# Altium project Mini-DSO-WaveGen-in-one.PrjPcb
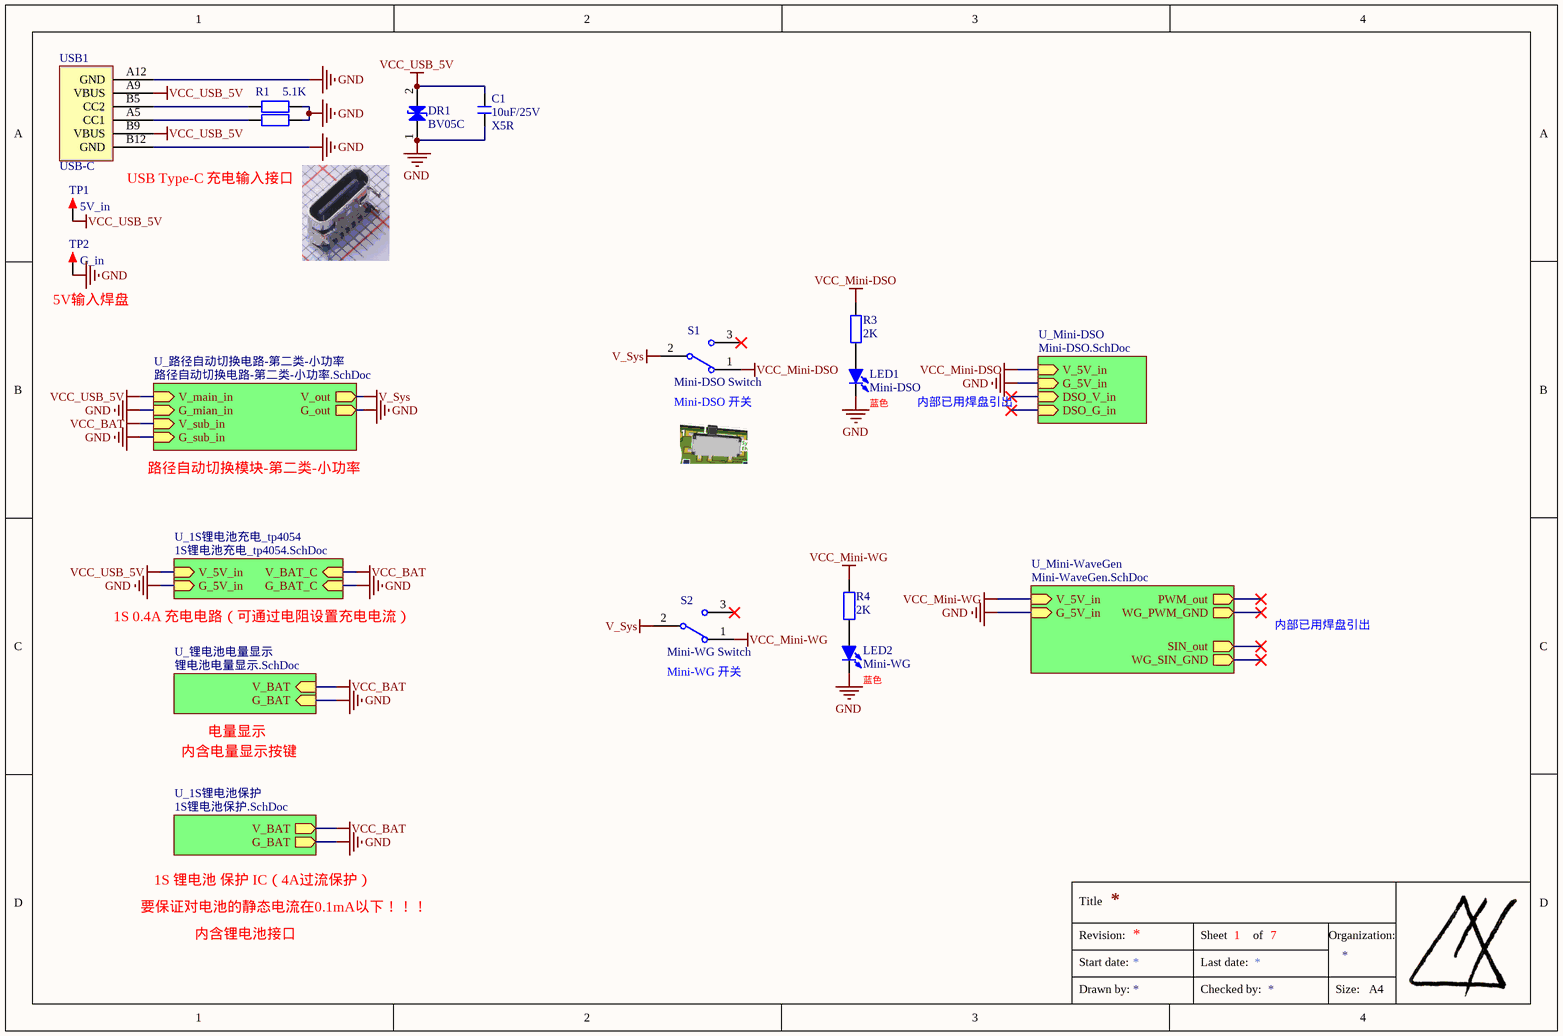
[diagram p0: Mini-DSO-WaveGen-in-one.SchDoc]
7 sheets, 160 parts. Net scope: hierarchical (ports join the sheet entries above them; power ports are global).
Board file: Mini-DSO-WaveGen-in-one.PcbDoc
Sheets:
  Mini-DSO-WaveGen-in-one.SchDoc
    U_1S锂电池保护 = 1S锂电池保护.SchDoc
    U_锂电池电量显示 = 锂电池电量显示.SchDoc
    U_1S锂电池充电_tp4054 = 1S锂电池充电_tp4054.SchDoc
    U_路径自动切换电路-第二类-小功率 = 路径自动切换电路-第二类-小功率.SchDoc
    U_Mini-WaveGen = Mini-WaveGen.SchDoc
    U_Mini-DSO = Mini-DSO.SchDoc

## Sheet Mini-DSO-WaveGen-in-one.SchDoc
size A4; SheetNumber: 1; SheetTotal: 7

### Parts
C1  10uF/25V  BOM名称: X5R  [C 0603_L]
DR1  BV05C  [SOD-323]
LED1  Mini-DSO  [LED 0805R]
LED2  Mini-WG  [LED 0805R]
R1  5.1K  [R 0402_L]
R2  5.1K  [R 0402_L]  (value not drawn)
R3  2K  [R 0402_L]
R4  2K  [R 0402_L]
S1  Mini-DSO Switch  [MSK-12C01-07]
S2  Mini-WG Switch  [MSK-12C01-07]
TP1  5V_in  [TEST 1.6]
TP2  G_in  [TEST 1.6]
USB1  USB-C  [USB-C/S_C]

### Sub-sheets
U_1S锂电池保护 = 1S锂电池保护.SchDoc: V_BAT (out), G_BAT (out)
U_1S锂电池充电_tp4054 = 1S锂电池充电_tp4054.SchDoc: V_5V_in (in), G_5V_in (in), V_BAT_C (in), G_BAT_C (in)
U_Mini-DSO = Mini-DSO.SchDoc: V_5V_in (in), G_5V_in (in), DSO_V_in (in), DSO_G_in (in)
U_Mini-WaveGen = Mini-WaveGen.SchDoc: V_5V_in (in), G_5V_in (in), PWM_out (out), SIN_out (out), WG_PWM_GND (out), WG_SIN_GND (out)
U_路径自动切换电路-第二类-小功率 = 路径自动切换电路-第二类-小功率.SchDoc: V_main_in (in), G_mian_in (in), V_out (out), G_out (out), V_sub_in (in), G_sub_in (in)
U_锂电池电量显示 = 锂电池电量显示.SchDoc: V_BAT (in), G_BAT (in)

### Nets
GND: C1.1 DR1.1(A) LED1.2(K) LED2.2(K) R1.1 R2.1 TP2.1 USB1.A12(GND) USB1.B12(GND) ; sheet U_1S锂电池保护/G_BAT, sheet U_锂电池电量显示/G_BAT, sheet U_1S锂电池充电_tp4054/G_5V_in, sheet U_1S锂电池充电_tp4054/G_BAT_C, sheet U_路径自动切换电路-第二类-小功率/G_mian_in, sheet U_路径自动切换电路-第二类-小功率/G_out, sheet U_路径自动切换电路-第二类-小功率/G_sub_in, sheet U_Mini-WaveGen/G_5V_in, sheet U_Mini-DSO/G_5V_in  [project net G_BAT_out]
GND_Mini-WG: sheet U_Mini-WaveGen/WG_PWM_GND, sheet U_Mini-WaveGen/WG_SIN_GND
V_Sys: S1.2 S2.2 ; sheet U_路径自动切换电路-第二类-小功率/V_out
VCC_BAT: sheet U_1S锂电池保护/V_BAT, sheet U_锂电池电量显示/V_BAT, sheet U_1S锂电池充电_tp4054/V_BAT_C, sheet U_路径自动切换电路-第二类-小功率/V_sub_in  [project net V_BAT_C]
VCC_Mini-DSO: R3.1 S1.1 ; sheet U_Mini-DSO/V_5V_in
VCC_Mini-WG: R4.1 S2.1 ; sheet U_Mini-WaveGen/V_5V_in
VCC_USB_5V: C1.2 DR1.2(K) TP1.1 USB1.A9(VBUS) USB1.B9(VBUS) ; sheet U_1S锂电池充电_tp4054/V_5V_in, sheet U_路径自动切换电路-第二类-小功率/V_main_in  [project net VCC_5V]
NetLED1_1: LED1.1(A) R3.2
NetLED2_1: LED2.1(A) R4.2
NetR1_2: R1.2 USB1.B5(CC2)
NetR2_2: R2.2 USB1.A5(CC1)

Not connected (* = marked no-connect by the designer): S1 3*; S2 3*

### Notes on the sheet
- (near USB1) USB Type-C 充电输入接口
- (near TP2) 5V输入焊盘
- (near S1) Mini-DSO 开关
- (near LED1) 蓝色
- 内部已用焊盘引出
- 路径自动切换模块-第二类-小功率
- 1S 0.4A 充电电路（可通过电阻设置充电电流）
- (near S2) Mini-WG 开关
- (near LED2) 蓝色
- 内含电量显示按键
- 电量显示
- 要保证对电池的静态电流在0.1mA以下！！！
- 1S 锂电池 保护 IC（4A过流保护）
- 内含锂电池接口
- Title
- Start date:
- Revision:
- Sheet
- Last date:
- of
- Organization:
- Drawn by:
- Checked by:
- Size:
- A4

### Library data of the parts
C1 = C X5R: 无极性贴片电容 X5R
DR1 = DR: 瞬态电压抑制二极管; 版权归属: 源创客; BOM名称: 瞬态电压抑制二极管; 学习资源: www.ooocke.com
LED1 = LED-SMD: 蓝色 贴片LED; 版权归属: 源创客; BOM名称: 蓝色 贴片LED; 学习资源: www.ooocke.com
LED2 = LED-SMD: 贴片LED 蓝色; BOM名称: 蓝色 贴片LED; 版权归属: 源创客; 学习资源: www.ooocke.com
R1-R4 = R: 贴片电阻 E-96 1%; BOM名称: E-96 1%
S1 S2 = SSW-1P: 1路拨动开关; pin to pad: 1>3 3>1; BOM名称: 拨动开关; 版权归属: 源创客; 学习资源: www.ooocke.com
TP1 TP2 = TEST: 测试点; 版权归属: 源创客; BOM名称: 测试点; 学习资源: www.ooocke.com
USB1 = USB-C_6P/S: USB-C_6P型母接口; BOM名称: USB-C型母接口; 版权归属: 源创客; 学习资源: www.ooocke.com

## Sheet 1S锂电池保护.SchDoc
size A4; SheetNumber: 4; SheetTotal: 7
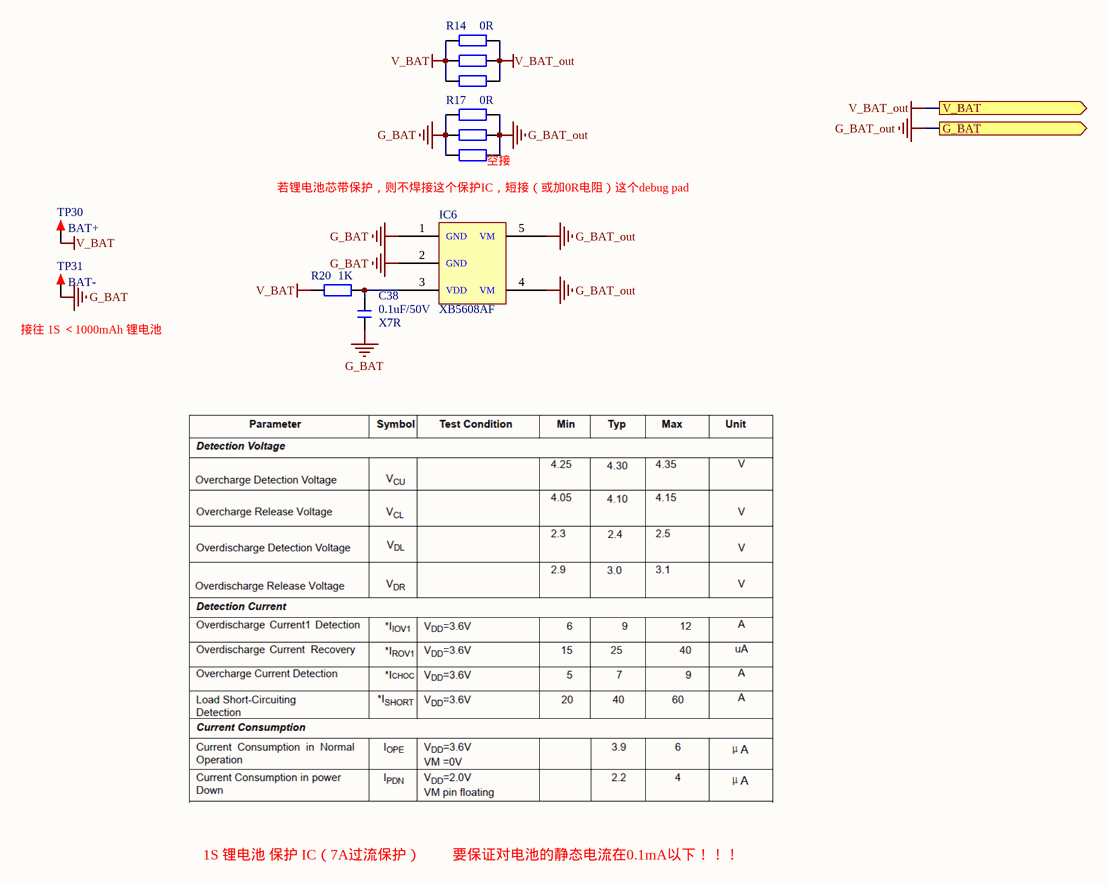
[diagram p1: 1S锂电池保护.SchDoc]

### Parts
C38  0.1uF/50V  BOM名称: X7R  [C 0402_L]
IC6  XB5608AF  [SOT23-5N]
R14  0R  [R 0402_L]
R15  0R  [R 0402_L]  (value not drawn)
R16  0R  [R 0402_L]  (value not drawn)
R17  0R  [R 0402_L]
R18  0R  [R 0402_L]  (value not drawn)
R19  0R  [R 0402_L]  (value not drawn)
R20  1K  [R 0402_L]
TP30  BAT+  [TEST 1.6]
TP31  BAT-  [TEST 1.6]

### Ports
G_BAT (out), V_BAT (out)

### Nets
G_BAT: C38.1 IC6.1 IC6.2 R17.1 R18.1 R19.1 TP31.1
G_BAT_out: IC6.4 IC6.5 R17.2 R18.2 R19.2 ; port G_BAT
V_BAT: R14.1 R15.1 R16.1 R20.1 TP30.1
V_BAT_out: R14.2 R15.2 R16.2 ; port V_BAT  [project net V_BAT_C]
NetC38_2: C38.2 IC6.3 R20.2

### Notes on the sheet
- 若锂电池芯带保护，则不焊接这个保护IC，短接（或加0R电阻）这个debug pad
- (near R19) 空接
- (near IC6) GND
- (near IC6) VM
- (near TP31) 接往 1S ＜1000mAh 锂电池
- (near IC6) VDD
- 1S 锂电池 保护 IC（7A过流保护）
- 要保证对电池的静态电流在0.1mA以下！！！
- Title
- Start date:
- Revision:
- Sheet
- Last date:
- of
- Organization:
- Drawn by:
- Checked by:
- Size:
- A4

### Library data of the parts
C38 = C X7R: 无极性贴片电容 X7R
IC6 = 5: 锂电池 二合一保护IC; BOM名称: 锂电池 二合一保护IC
R14-R20 = R: 贴片电阻 E-96 1%; BOM名称: E-96 1%
TP30 TP31 = TEST: 测试点; 版权归属: 源创客; BOM名称: 测试点; 学习资源: www.ooocke.com

## Sheet 锂电池电量显示.SchDoc
size A4; SheetNumber: 5; SheetTotal: 7
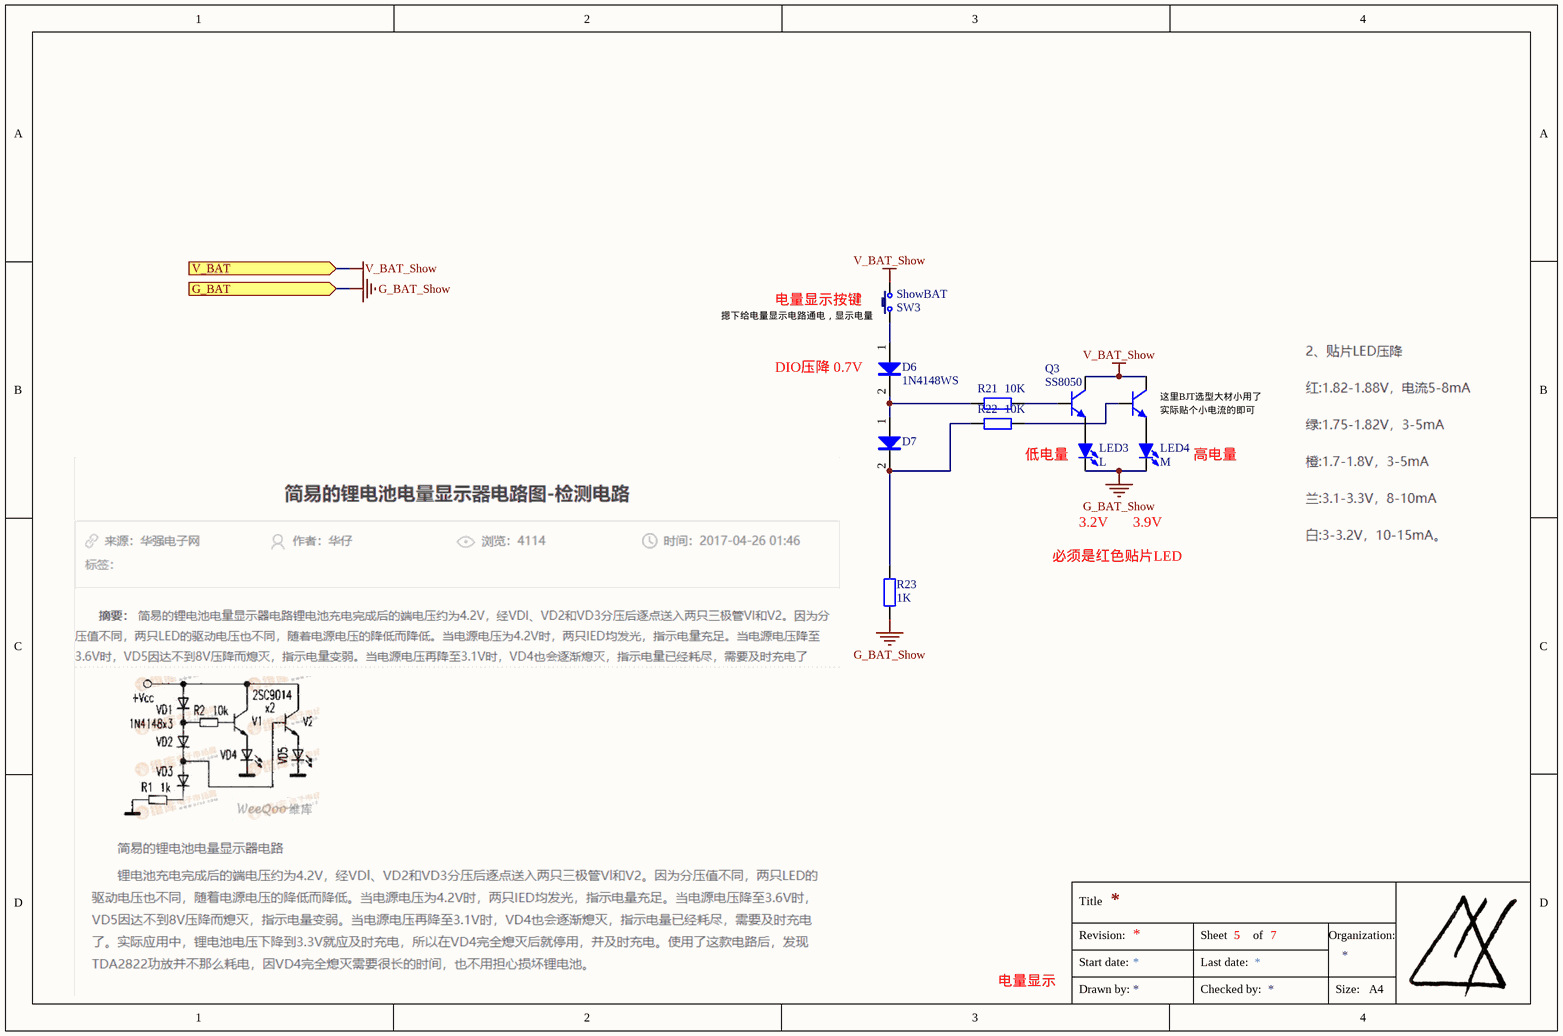
[diagram p2: 锂电池电量显示.SchDoc]

### Parts
D6  1N4148WS  [SOD-323]
D7  1N4148WS  [SOD-323]  (value not drawn)
LED3  L  [LED 0805R]
LED4  M  [LED 0805R]
Q3  SS8050  [SOT23-3N]
Q4  SS8050  [SOT23-3N]  (value not drawn)
R21  10K  [R 0402_L]
R22  10K  [R 0402_L]
R23  1K  [R 0402_L]
SW3  ShowBAT  [TSW DIP-3*6*5_V]

### Ports
G_BAT (in), V_BAT (in)

### Nets
G_BAT_Show: LED3.2(K) LED4.2(K) R23.2 ; port G_BAT  [project net G_BAT_out]
V_BAT_Show: Q3.3(C) Q4.3(C) SW3.2 ; port V_BAT  [project net V_BAT_C]
NetD6_1: D6.1(A) SW3.1
NetD6_2: D6.2(K) D7.1(A) R21.1
NetD7_2: D7.2(K) R22.1 R23.1
NetLED3_1: LED3.1(A) Q3.2(E)
NetLED4_1: LED4.1(A) Q4.2(E)
NetQ3_1: Q3.1(B) R21.2
NetQ4_1: Q4.1(B) R22.2

### Notes on the sheet
- 电量显示按键
- 摁下给电量显示电路通电，显示电量
- DIO压降 0.7V
- (near Q4) 这里BJT选型大材小用了
- (near Q4) 实际贴个小电流的即可
- 低电量
- 高电量
- 必须是红色贴片LED
- 3.2V
- 3.9V
- 电量显示
- Title
- Start date:
- Revision:
- Sheet
- Last date:
- of
- Organization:
- Drawn by:
- Checked by:
- Size:
- A4

### Library data of the parts
D6 D7 = 1N4148: 高速开关二极管; 版权归属: 源创客; BOM名称: 高速开关二极管; 学习资源: www.ooocke.com
LED3 LED4 = LED-SMD: 贴片LED 红色; 版权归属: 源创客; BOM名称: 贴片LED 红色; 学习资源: www.ooocke.com
Q3 Q4 = 8050-SMD: 高频放大-NPN型; 版权归属: 源创客; 属性: 40V 1.5A 1W 100MHZ; BOM名称: 高频放大-NPN型; 学习资源: www.ooocke.com
R21-R23 = R: 贴片电阻 E-96 1%; BOM名称: E-96 1%
SW3 = TSW 3x6: 3x6轻触开关; 版权归属: 源创客; BOM名称: 3x6轻触开关; 学习资源: www.ooocke.com

## Sheet 1S锂电池充电_tp4054.SchDoc
size A4; SheetNumber: 6; SheetTotal: 7
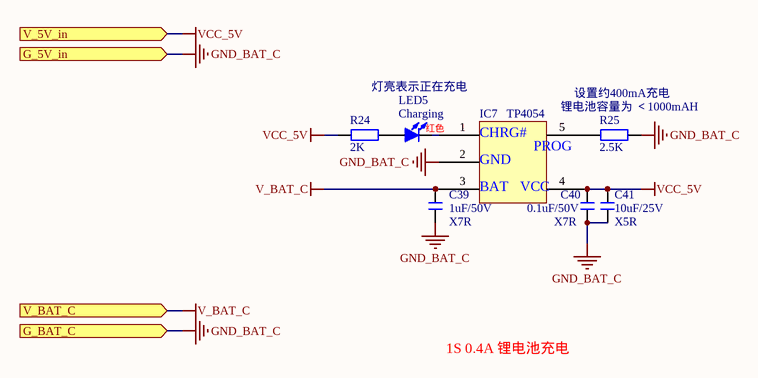
[diagram p3: 1S锂电池充电_tp4054.SchDoc]

### Parts
C39  1uF/50V  BOM名称: X7R  [C 0603_L]
C40  0.1uF/50V  BOM名称: X7R  [C 0402_L]
C41  10uF/25V  BOM名称: X5R  [C 0603_L]
IC7  TP4054  [SOT23-5N]
LED5  Charging  [LED 0805R]
R24  2K  [R 0402_L]
R25  2.5K  [R 0402_L]

### Ports
G_5V_in (in), G_BAT_C (in), V_5V_in (in), V_BAT_C (in)

### Nets
GND_BAT_C: C39.1 C40.2 C41.1 IC7.2 R25.2 ; port G_5V_in, port G_BAT_C  [project net G_BAT_out]
V_BAT_C: C39.2 IC7.3 ; port V_BAT_C
VCC_5V: C40.1 C41.2 IC7.4 R24.2 ; port V_5V_in
NetIC7_1: IC7.1 LED5.2(K)
NetIC7_5: IC7.5 R25.1
NetLED5_1: LED5.1(A) R24.1

### Notes on the sheet
- 灯亮表示正在充电
- 锂电池容量为 ＜1000mAH
- 设置约400mA充电
- (near LED5) 红色
- (near IC7) CHRG#
- (near IC7) GND
- (near IC7) BAT
- (near IC7) VCC
- (near IC7) PROG
- 1S 0.4A 锂电池充电
- Title
- Start date:
- Revision:
- Sheet
- Last date:
- of
- Organization:
- Drawn by:
- Checked by:
- Size:
- A4

### Library data of the parts
C39 C40 = C X7R: 无极性贴片电容 X7R
C41 = C X5R: 无极性贴片电容 X5R
IC7 = 5: 1S锂电充电; BOM名称: 1S锂电充电
LED5 = LED-SMD: 红色 贴片LED; 版权归属: 源创客; BOM名称: 红色 贴片LED; 学习资源: www.ooocke.com
R24 R25 = R: 贴片电阻 E-96 1%; BOM名称: E-96 1%

## Sheet 路径自动切换电路-第二类-小功率.SchDoc
size A4; SheetNumber: 7; SheetTotal: 7
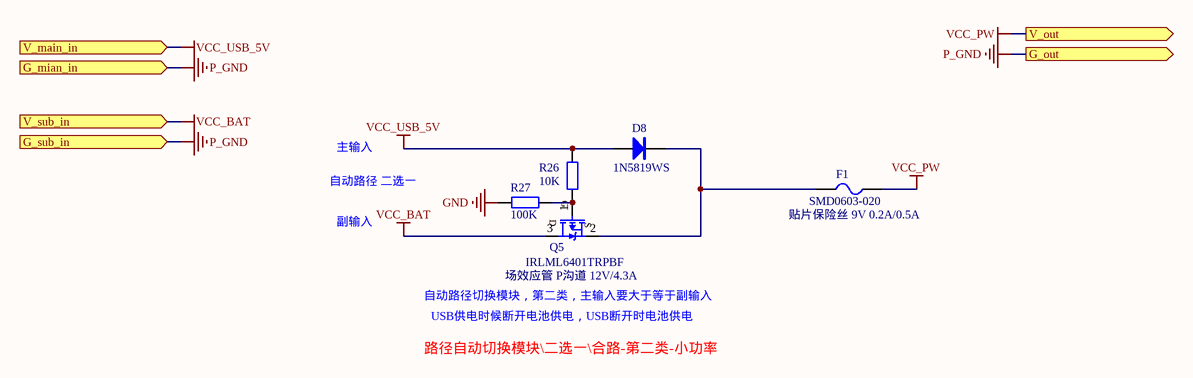
[diagram p4: 路径自动切换电路-第二类-小功率.SchDoc]

### Parts
D8  1N5819WS  [SOD-323]
F1  SMD0603-020  [FU 0603]
Q5  IRLML6401TRPBF  [SOT23-3N]
R26  10K  [R 0402_L]
R27  100K  [R 0402_L]

### Ports
G_mian_in (in), G_out (out), G_sub_in (in), V_main_in (in), V_out (out), V_sub_in (in)

### Nets
GND: R27.1 ; port G_mian_in, port G_out, port G_sub_in  [also labelled P_GND]  [project net G_BAT_out]
VCC_BAT: Q5.3(D) ; port V_sub_in  [project net V_BAT_C]
VCC_PW: F1.1 ; port V_out  [project net V_Sys]
VCC_USB_5V: D8.1(A) R26.2 ; port V_main_in  [project net VCC_5V]
NetD8_2: D8.2(K) F1.2 Q5.2(S)
NetQ5_1: Q5.1(G) R26.1 R27.2

### Notes on the sheet
- 主输入
- 自动路径 二选一
- 副输入
- 自动路径切换模块，第二类，主输入要大于等于副输入
- 路径自动切换模块\二选一\合路-第二类-小功率
- USB供电时候断开电池供电，USB断开时电池供电
- Title
- Start date:
- Revision:
- Sheet
- Last date:
- of
- Organization:
- Drawn by:
- Checked by:
- Size:
- A4

### Library data of the parts
D8 = 1N5819: 肖特基二极管; 版权归属: 源创客; 属性: 40V/2A; BOM名称: 肖特基二极管; 学习资源: www.ooocke.com
F1 = FU: 贴片保险丝 9V 0.2A/0.5A; 版权归属: 源创客; BOM名称: 贴片保险丝 9V 0.2A/0.5A; 学习资源: www.ooocke.com
Q5 = P-MOS: 场效应管 P沟道 12V/4.3A; 版权归属: 源创客; 学习资源: www.ooocke.com; BOM名称: 场效应管 P沟道 12V/4.3A
R26 R27 = R: 贴片电阻 E-96 1%; BOM名称: E-96 1%

## Sheet Mini-WaveGen.SchDoc
size A4; SheetNumber: 3; SheetTotal: 7
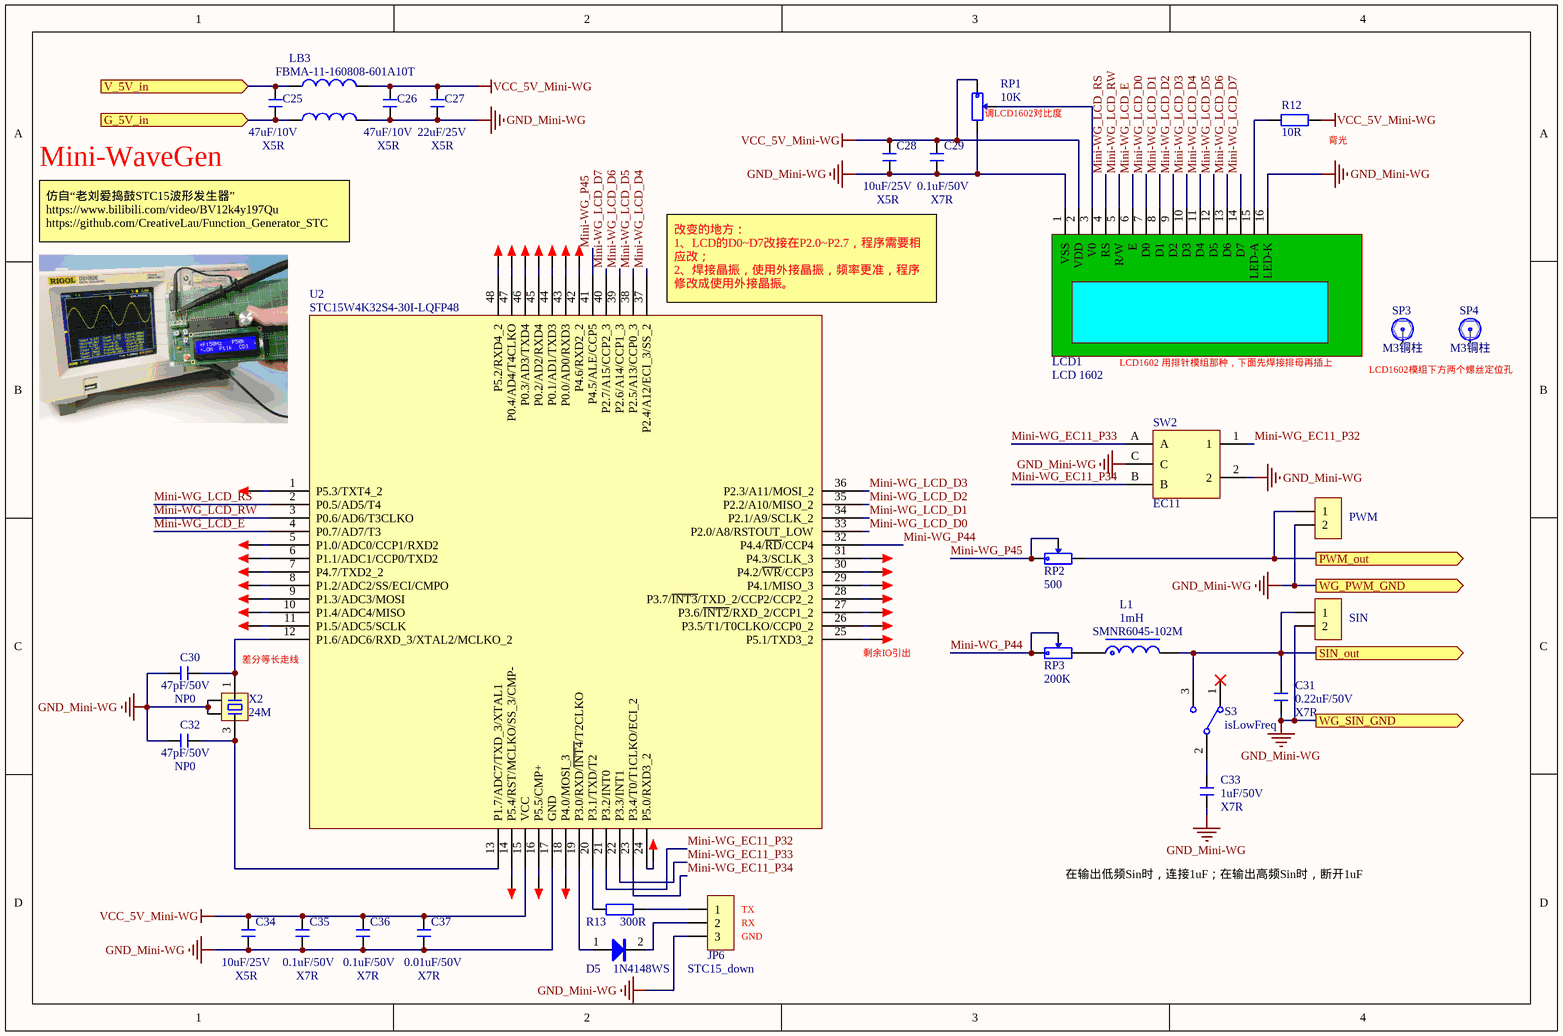
[diagram p5: Mini-WaveGen.SchDoc]

### Parts
C25  47uF/10V  BOM名称: X5R  [C 1206_L]
C26  47uF/10V  BOM名称: X5R  [C 1206_L]
C27  22uF/25V  BOM名称: X5R  [C 0805_L]
C28  10uF/25V  BOM名称: X5R  [C 0603_L]
C29  0.1uF/50V  BOM名称: X7R  [C 0402_L]
C30  47pF/50V  BOM名称: NP0  [C 0402_L]
C31  0.22uF/50V  BOM名称: X7R  [C 0603_L]
C32  47pF/50V  BOM名称: NP0  [C 0402_L]
C33  1uF/50V  BOM名称: X7R  [C 0603_L]
C34  10uF/25V  BOM名称: X5R  [C 0603_L]
C35  0.1uF/50V  BOM名称: X7R  [C 0402_L]
C36  0.1uF/50V  BOM名称: X7R  [C 0402_L]
C37  0.01uF/50V  BOM名称: X7R  [C 0402_L]
D5  1N4148WS  [SOD-323]
JP4  PWM  [HDR2.54-WS-2P]
JP5  SIN  [HDR2.54-WS-2P]
JP6  STC15_down  [HDR2.54-WS-3P]
L1  1mH  [NR6045]
LB3  FBMA-11-160808-601A10T  [FB 0603_L]
LB4  FBMA-11-160808-601A10T  [FB 0603_L]  (value not drawn)
LCD1  LCD 1602  [LCD-1602]
R12  10R  [R 0805_L]
R13  300R  [R 0402_L]
RP1  10K  [3362P]
RP2  500  [3362P]
RP3  200K  [3362P]
S3  isLowFreq  [MSK-12C01-07]
SP3  M3铜柱  [M3x4_L]
SP4  M3铜柱  [M3x4_L]
SW2  EC11  [EC11-B]
TP4  IO  [TEST 1]  (value not drawn)
TP5  IO  [TEST 1]  (value not drawn)
TP6  IO  [TEST 1]  (value not drawn)
TP7  IO  [TEST 1]  (value not drawn)
TP8  IO  [TEST 1]  (value not drawn)
TP9  IO  [TEST 1]  (value not drawn)
TP10  IO  [TEST 1]  (value not drawn)
TP11  IO  [TEST 1]  (value not drawn)
TP12  IO  [TEST 1]  (value not drawn)
TP13  IO  [TEST 1]  (value not drawn)
TP14  IO  [TEST 1]  (value not drawn)
TP15  IO  [TEST 1]  (value not drawn)
TP16  IO  [TEST 1]  (value not drawn)
TP17  IO  [TEST 1]  (value not drawn)
TP18  IO  [TEST 1]  (value not drawn)
TP19  IO  [TEST 1]  (value not drawn)
TP20  IO  [TEST 1]  (value not drawn)
TP21  IO  [TEST 1]  (value not drawn)
TP22  IO  [TEST 1]  (value not drawn)
TP23  IO  [TEST 1]  (value not drawn)
TP24  IO  [TEST 1]  (value not drawn)
TP25  IO  [TEST 1]  (value not drawn)
TP26  IO  [TEST 1]  (value not drawn)
TP27  IO  [TEST 1]  (value not drawn)
TP28  IO  [TEST 1]  (value not drawn)
TP29  IO  [TEST 1]  (value not drawn)
U2  STC15W4K32S4-30I-LQFP48  [LQFP48]
X2  24M  [OSC 3225-4P]

### Ports
G_5V_in (in), PWM_out (out), SIN_out (out), V_5V_in (in), WG_PWM_GND (out), WG_SIN_GND (out)

### Nets
G_BAT_out: C25.1 LB4.1 ; port G_5V_in
GND_Mini-WG: C26.1 C27.1 C28.1 C29.2 C30.2 C31.2 C32.2 C33.1 C34.1 C35.2 C36.2 C37.2 JP4.2 JP5.2 JP6.3 LB4.2 LCD1.1(VSS) LCD1.16(LED-K) RP1.3 SW2.2 SW2.C U2.17(GND) X2.2 X2.4 ; port WG_PWM_GND, port WG_SIN_GND
VCC_5V_Mini-WG: C26.2 C27.2 C28.2 C29.1 C34.2 C35.1 C36.1 C37.1 LB3.2 LCD1.2(VDD) R12.1 RP1.1 U2.15(VCC)
VCC_Mini-WG: C25.2 LB3.1 ; port V_5V_in
Mini-WG_EC11_P32: SW2.1 U2.21(P3.2/INT0)
Mini-WG_EC11_P33: SW2.A U2.22(P3.3/INT1)
Mini-WG_EC11_P34: SW2.B U2.23(P3.4/T0/T1CLKO/ECI_2)
Mini-WG_LCD_D0: LCD1.7(D0) U2.33(P2.0/A8/RSTOUT_LOW)
Mini-WG_LCD_D1: LCD1.8(D1) U2.34(P2.1/A9/SCLK_2)
Mini-WG_LCD_D2: LCD1.9(D2) U2.35(P2.2/A10/MISO_2)
Mini-WG_LCD_D3: LCD1.10(D3) U2.36(P2.3/A11/MOSI_2)
Mini-WG_LCD_D4: LCD1.11(D4) U2.37(P2.4/A12/ECI_3/SS_2)
Mini-WG_LCD_D5: LCD1.12(D5) U2.38(P2.5/A13/CCP0_3)
Mini-WG_LCD_D6: LCD1.13(D6) U2.39(P2.6/A14/CCP1_3)
Mini-WG_LCD_D7: LCD1.14(D7) U2.40(P2.7/A15/CCP2_3)
Mini-WG_LCD_E: LCD1.6(E) U2.4(P0.7/AD7/T3)
Mini-WG_LCD_RS: LCD1.4(RS) U2.2(P0.5/AD5/T4)
Mini-WG_LCD_RW: LCD1.5(R/W) U2.3(P0.6/AD6/T3CLKO)
Mini-WG_P44: RP3.1 RP3.2 U2.32(P4.4/~{RD}/CCP4)
Mini-WG_P45: RP2.1 RP2.2 U2.41(P4.5/ALE/CCP5)
NetC30_1: C30.1 U2.12(P1.6/ADC6/RXD_3/XTAL2/MCLKO_2) X2.1
NetC31_1: C31.1 JP5.1 L1.2 S3.3 ; port SIN_out
NetC32_1: C32.1 U2.13(P1.7/ADC7/TXD_3/XTAL1) X2.3
NetC33_2: C33.2 S3.2
NetD5_1: D5.1(A) U2.19(P3.0/RXD/~{INT4}/T2CLKO)
NetD5_2: D5.2(K) JP6.2
NetJP4_1: JP4.1 RP2.3 ; port PWM_out
NetJP6_1: JP6.1 R13.1
NetL1_1: L1.1 RP3.3
NetLCD1_3: LCD1.3(V0) RP1.2
NetLCD1_15: LCD1.15(LED-A) R12.2
NetR13_2: R13.2 U2.20(P3.1/TXD/T2)
NetTP4_1: TP4.1 U2.48(P5.2/RXD4_2)
NetTP5_1: TP5.1 U2.47(P0.4/AD4/T4CLKO)
NetTP6_1: TP6.1 U2.46(P0.3/AD3/TXD4)
NetTP7_1: TP7.1 U2.45(P0.2/AD2/RXD4)
NetTP8_1: TP8.1 U2.44(P0.1/AD1/TXD3)
NetTP9_1: TP9.1 U2.43(P0.0/AD0/RXD3)
NetTP10_1: TP10.1 U2.42(P4.6/RXD2_2)
NetTP11_1: TP11.1 U2.1(P5.3/TXT4_2)
NetTP12_1: TP12.1 U2.31(P4.3/SCLK_3)
NetTP13_1: TP13.1 U2.5(P1.0/ADC0/CCP1/RXD2)
NetTP14_1: TP14.1 U2.30(P4.2/~{WR}/CCP3)
NetTP15_1: TP15.1 U2.6(P1.1/ADC1/CCP0/TXD2)
NetTP16_1: TP16.1 U2.29(P4.1/MISO_3)
NetTP17_1: TP17.1 U2.7(P4.7/TXD2_2)
NetTP18_1: TP18.1 U2.28(P3.7/~{INT3}/TXD_2/CCP2/CCP2_2)
NetTP19_1: TP19.1 U2.8(P1.2/ADC2/SS/ECI/CMPO)
NetTP20_1: TP20.1 U2.27(P3.6/~{INT2}/RXD_2/CCP1_2)
NetTP21_1: TP21.1 U2.9(P1.3/ADC3/MOSI)
NetTP22_1: TP22.1 U2.26(P3.5/T1/T0CLKO/CCP0_2)
NetTP23_1: TP23.1 U2.10(P1.4/ADC4/MISO)
NetTP24_1: TP24.1 U2.25(P5.1/TXD3_2)
NetTP25_1: TP25.1 U2.11(P1.5/ADC5/SCLK)
NetTP26_1: TP26.1 U2.24(P5.0/RXD3_2)
NetTP27_1: TP27.1 U2.14(P5.4/RST/MCLKO/SS_3/CMP-)
NetTP28_1: TP28.1 U2.16(P5.5/CMP+)
NetTP29_1: TP29.1 U2.18(P4.0/MOSI_3)

Not connected (* = marked no-connect by the designer): S3 1*; SP3 1; SP4 1

### Notes on the sheet
- (near RP1) 调LCD1602对比度
- Mini-WaveGen
- (near R12) 背光
- 仿自“老刘爱捣鼓STC15波形发生器”
  https://www.bilibili.com/video/BV12k4y197Qu
  https://github.com/CreativeLau/Function_Generator_STC
- (near U2) 改变的地方：
  1、LCD的D0~D7改接在P2.0~P2.7，程序需要相应改；
  2、焊接晶振，使用外接晶振，频率更准，程序修改成使用外接晶振。
- LCD1602 用排针模组那种，下面先焊接排母再插上
- LCD1602模组下方两个螺丝定位孔
- (near TP24) 剩余IO引出
- 差分等长走线
- (near JP6) TX
- (near JP6) RX
- 在输出低频Sin时，连接1uF；在输出高频Sin时，断开1uF
- (near JP6) GND
- Title
- Start date:
- Revision:
- Sheet
- Last date:
- of
- Organization:
- Drawn by:
- Checked by:
- Size:
- A4

### Library data of the parts
C25-C28 C34 = C X5R: 无极性贴片电容 X5R
C29 C31 C33 C35-C37 = C X7R: 无极性贴片电容 X7R
C30 C32 = C NP0: 无极性贴片电容 NP0
D5 = 1N4148: 高速开关二极管; 版权归属: 源创客; BOM名称: 高速开关二极管; 学习资源: www.ooocke.com
JP4 JP5 = Header 2: 2P接插件; 版权归属: 源创客; BOM名称: 2P接插件; 学习资源: www.ooocke.com
JP6 = Header 3: 3P接插件; 版权归属: 源创客; BOM名称: 3P接插件; 学习资源: www.ooocke.com
L1 = L-NR: SMNR6045-102M; 版权归属: 源创客; BOM名称: SMNR6045-102M; 学习资源: www.ooocke.com
LB3 LB4 = LB: 磁珠 600R@100MHz; 版权归属: 源创客; BOM名称: 磁珠 600R@100MHz; 学习资源: www.ooocke.com
LCD1 = LCD 1602: 版权归属: 源创客; BOM名称: LCD 1602; 学习资源: www.ooocke.com
R12 R13 = R: 贴片电阻 E-96 1%; BOM名称: E-96 1%
RP1-RP3 = RP-ID: 插件单联电位器; BOM名称: 插件电位器; 版权归属: 源创客; 学习资源: www.ooocke.com
S3 = SSW-1P: 1路拨动开关; pin to pad: 1>3 3>1; BOM名称: 拨动开关; 版权归属: 源创客; 学习资源: www.ooocke.com
SP3 SP4 = 铜柱小焊盘: 铜柱; 版权归属: 源创客; BOM名称: 铜柱; 学习资源: www.ooocke.com
SW2 = EC11: 数字开关编码器; BOM名称: 数字编码开关; 版权归属: 源创客; 学习资源: www.ooocke.com
TP4-TP29 = TEST: 测试点; 版权归属: 源创客; BOM名称: 测试点; 学习资源: www.ooocke.com
U2 = STC15W4K60S4_LQFP48
X2 = XTAL-4P: 4脚无源晶振; 版权归属: 源创客; BOM名称: 4脚无源晶振; 学习资源: www.ooocke.com

## Sheet Mini-DSO.SchDoc
size A3; SheetNumber: 2; SheetTotal: 7
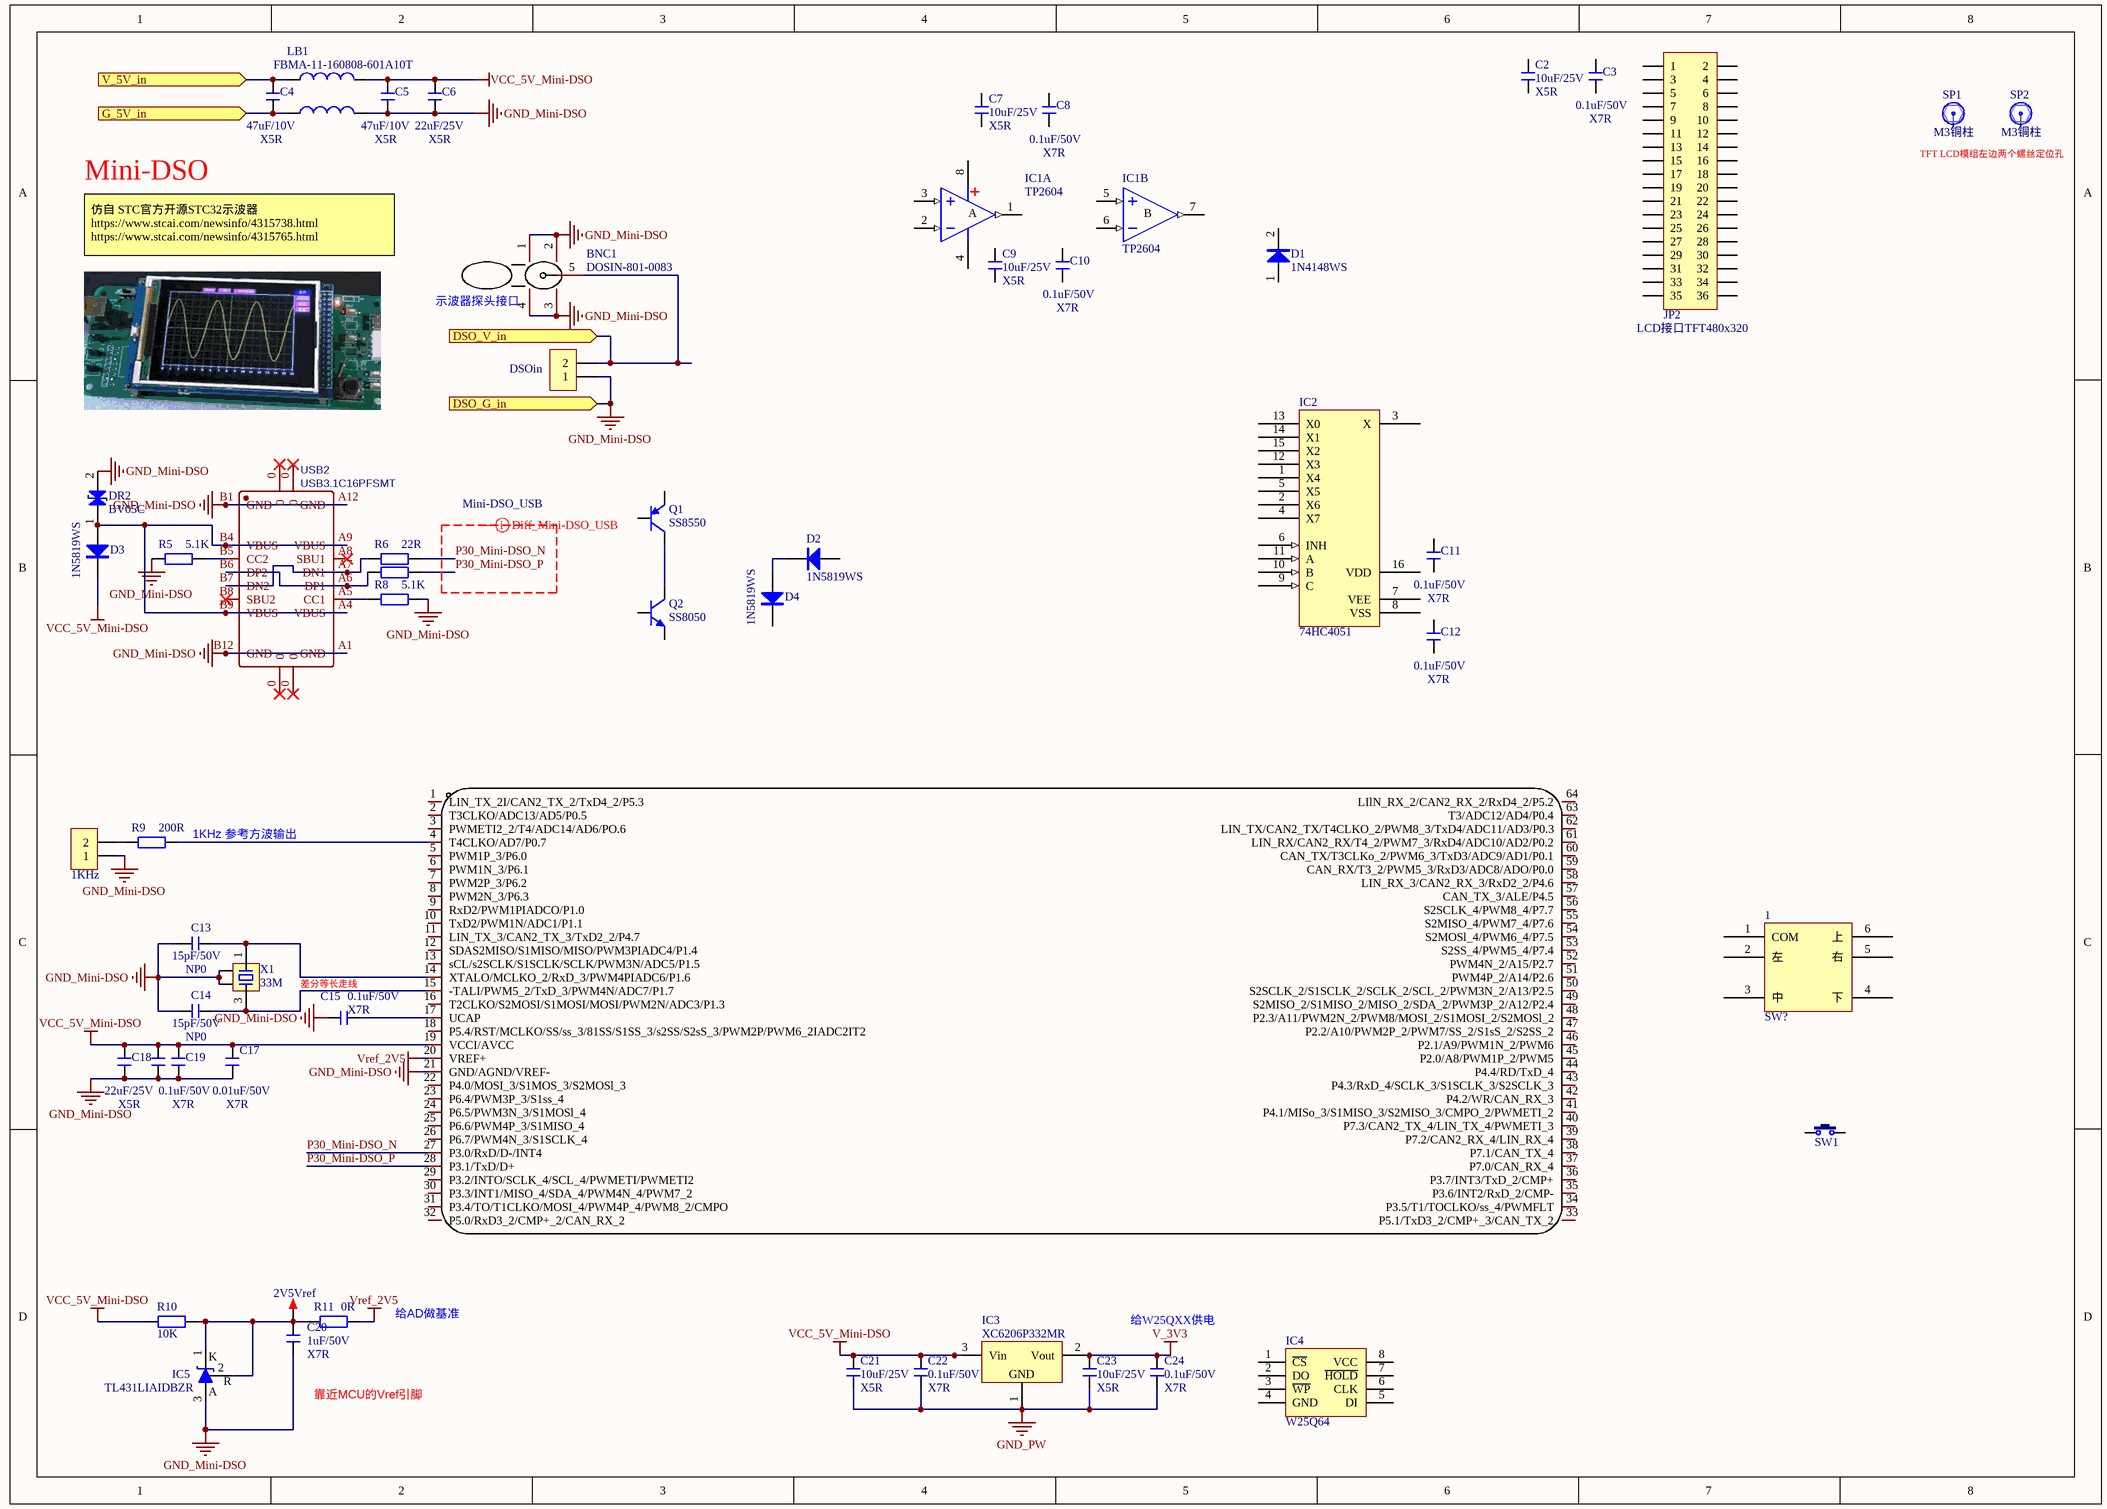
[diagram p6: Mini-DSO.SchDoc]

### Parts
1  SW?  [TSW 10x10x9-5Key-LS]
BNC1  DOSIN-801-0083  [BNC-TH_DOSIN-801-0083]
C2  10uF/25V  BOM名称: X5R  [C 0603_L]
C3  0.1uF/50V  BOM名称: X7R  [C 0402_L]
C4  47uF/10V  BOM名称: X5R  [C 1206_L]
C5  47uF/10V  BOM名称: X5R  [C 1206_L]
C6  22uF/25V  BOM名称: X5R  [C 0805_L]
C7  10uF/25V  BOM名称: X5R  [C 0603_L]
C8  0.1uF/50V  BOM名称: X7R  [C 0402_L]
C9  10uF/25V  BOM名称: X5R  [C 0603_L]
C10  0.1uF/50V  BOM名称: X7R  [C 0402_L]
C11  0.1uF/50V  BOM名称: X7R  [C 0402_L]
C12  0.1uF/50V  BOM名称: X7R  [C 0402_L]
C13  15pF/50V  BOM名称: NP0  [C 0402_L]
C14  15pF/50V  BOM名称: NP0  [C 0402_L]
C15  0.1uF/50V  BOM名称: X7R  [C 0402_L]
C16  0.1uF/50V  [C 0402_L]  (value not drawn)
C17  0.01uF/50V  BOM名称: X7R  [C 0402_L]
C18  22uF/25V  BOM名称: X5R  [C 0805_L]
C19  0.1uF/50V  BOM名称: X7R  [C 0402_L]
C20  1uF/50V  BOM名称: X7R  [C 0603_L]
C21  10uF/25V  BOM名称: X5R  [C 0603_L]
C22  0.1uF/50V  BOM名称: X7R  [C 0402_L]
C23  10uF/25V  BOM名称: X5R  [C 0603_L]
C24  0.1uF/50V  BOM名称: X7R  [C 0402_L]
D1  1N4148WS  [SOD-323]
D2  1N5819WS  [SOD-323]
D3  1N5819WS  [SOD-323]
D4  1N5819WS  [SOD-323]
DR2  BV05C  [SOD-323]
IC1  TP2604  [SOP8_N]  (parts A,B of 2)
IC2  74HC4051  [SOP16_N]
IC3  XC6206P332MR  [SOT23-3N]
IC4  W25Q64  [SOP8W_N]
IC5  TL431LIAIDBZR  [SOT23-3N]
JP1  DSOin  [HDR2.54-WS-2P]
JP2  LCD接口TFT480x320  [HDR2.54-LI-2x18P]
JP3  1KHz  [HDR2.54-WS-2P]
LB1  FBMA-11-160808-601A10T  [FB 0603_L]
LB2  FBMA-11-160808-601A10T  [FB 0603_L]  (value not drawn)
Q1  SS8550  [SOT23-3N]
Q2  SS8050  [SOT23-3N]
R5  5.1K  [R 0402_L]
R6  22R  [R 0402_L]
R7  22R  [R 0402_L]  (value not drawn)
R8  5.1K  [R 0402_L]
R9  200R  [R 0402_L]
R10  10K  [R 0402_L]
R11  0R  [R 0402_L]
SP1  M3铜柱  [M3x4_L]
SP2  M3铜柱  [M3x4_L]
SW1  3x6x5  [TSW SMD-3*6*2.5]  (value not drawn)
TP3  2V5Vref  [TEST 1]
U1  STC32G12K128-Beta-LQFP64  [LQFP64 14x14_N]  (value not drawn)
USB2  USB3.1C16PFSMT  [TYPE-C-USB-17]
X1  33M  [OSC 3225-4P]

### Ports
DSO_G_in (in), DSO_V_in (in), G_5V_in (in), V_5V_in (in)

### Nets
G_BAT_out: C4.1 LB2.1 ; port G_5V_in
GND_Mini-DSO: BNC1.1 BNC1.2 BNC1.3 BNC1.4 C5.1 C6.1 C13.2 C14.2 C15.2 C16.2 C17.2 C18.1 C19.2 C20.1 DR2.2(K) IC5.3(A) JP1.1 JP3.1 LB2.2 R5.2 R8.1 U1.21(GND/AGND/VREF-) USB2.A1(GND) USB2.A12(GND) USB2.B1(GND) USB2.B12(GND) X1.2 X1.4 ; port DSO_G_in
GND_PW: C21.1 C22.2 C23.1 C24.2 IC3.1(GND)
V_3V3: C23.2 C24.1 IC3.2(Vout)
VCC_5V_Mini-DSO: C5.2 C6.2 C16.1 C17.1 C18.2 C19.1 C21.2 C22.1 D3.2(K) IC3.3(Vin) LB1.2 R10.2 U1.19(VCCI/AVCC)
VCC_Mini-DSO: C4.2 LB1.1 ; port V_5V_in
Vref_2V5: R11.2 U1.20(VREF+)
P30_Mini-DSO_N: R6.1 U1.27(P3.0/RxD/D-/INT4)
P30_Mini-DSO_P: R7.1 U1.28(P3.1/TxD/D+)
NetBNC1_5: BNC1.5 JP1.2 ; port DSO_V_in
NetC13_1: C13.1 U1.14(XTALO/MCLKO_2/RxD_3/PWM4PIADC6/P1.6) X1.1
NetC14_1: C14.1 U1.15(-TALI/PWM5_2/TxD_3/PWM4N/ADC7/P1.7) X1.3
NetC15_1: C15.1 U1.17(UCAP)
NetC20_2: C20.2 IC5.1(K) IC5.2(R) R10.1 R11.1 TP3.1
NetD2_2: D2.2(K) D4.1(A)
NetD3_1: D3.1(A) DR2.1(A) USB2.A4(VBUS) USB2.A9(VBUS) USB2.B4(VBUS) USB2.B9(VBUS)
NetJP3_2: JP3.2 R9.2
NetQ1_3: Q1.3(C) Q2.3(C)
NetR5_1: R5.1 USB2.B5(CC2)
NetR6_2: R6.2 USB2.A7(DN1) USB2.B7(DN2)
NetR7_2: R7.2 USB2.A6(DP1) USB2.B6(DP2)
NetR8_2: R8.2 USB2.A5(CC1)
NetR9_1: R9.1 U1.4(T4CLKO/AD7/P0.7)

Not connected (* = marked no-connect by the designer): 1 1(COM) 2(左) 3(中) 4(下) 5(右) 6(上); C2 1 2; C3 1 2; C7 1 2; C8 1 2; C9 1 2; C10 1 2; C11 1 2; C12 1 2; D1 1(A) 2(K); D2 1(A); D4 2(K); IC1 1(OUT) 2(IN-) 3(IN+) 4(V-) 5(IN+) 6(IN-) 7(OUT) 8(V+); IC2 1(X4) 2(X6) 3(X) 4(X7) 5(X5) 6(INH) 7(VEE) 8(VSS) 9(C) 10(B) 11(A) 12(X3) 13(X0) 14(X1) 15(X2) 16(VDD); IC4 1(~{CS}) 2(DO) 3(~{WP}) 4(GND) 5(DI) 6(CLK) 7(~{HOLD}) 8(VCC); JP2 1 2 3 4 5 6 7 8 9 10 11 12 13 14 15 16 17 18 19 20 21 22 23 24 25 26 27 28 29 30 31 32 33 34 35 36; Q1 1(B) 2(E); Q2 1(B) 2(E); SP1 1; SP2 1; SW1 1 2; U1 1(LIN_TX_2I/CAN2_TX_2/TxD4_2/P5.3) 2(T3CLKO/ADC13/AD5/P0.5) 3(PWMETI2_2/T4/ADC14/AD6/PO.6) 5(PWM1P_3/P6.0) 6(PWM1N_3/P6.1) 7(PWM2P_3/P6.2) 8(PWM2N_3/P6.3) 9(RxD2/PWM1PIADCO/P1.0) 10(TxD2/PWM1N/ADC1/P1.1) 11(LIN_TX_3/CAN2_TX_3/TxD2_2/P4.7) 12(SDAS2MISO/S1MISO/MISO/PWM3PIADC4/P1.4) 13(sCL/s2SCLK/S1SCLK/SCLK/PWM3N/ADC5/P1.5) 16(T2CLKO/S2MOSI/S1MOSI/MOSI/PWM2N/ADC3/P1.3) 18(P5.4/RST/MCLKO/SS/ss_3/81SS/S1SS_3/s2SS/S2sS_3/PWM2P/PWM6_2IADC2IT2) 22(P4.0/MOSI_3/S1MOS_3/S2MOSl_3) 23(P6.4/PWM3P_3/S1ss_4) 24(P6.5/PWM3N_3/S1MOSl_4) 25(P6.6/PWM4P_3/S1MISO_4) 26(P6.7/PWM4N_3/S1SCLK_4) 29(P3.2/INTO/SCLK_4/SCL_4/PWMETI/PWMETI2) 30(P3.3/INT1/MISO_4/SDA_4/PWM4N_4/PWM7_2) 31(P3.4/TO/T1CLKO/MOSI_4/PWM4P_4/PWM8_2/CMPO) 32(P5.0/RxD3_2/CMP+_2/CAN_RX_2) 33(P5.1/TxD3_2/CMP+_3/CAN_TX_2) 34(P3.5/T1/TOCLKO/ss_4/PWMFLT) 35(P3.6/INT2/RxD_2/CMP-) 36(P3.7/INT3/TxD_2/CMP+) 37(P7.0/CAN_RX_4) 38(P7.1/CAN_TX_4) 39(P7.2/CAN2_RX_4/LIN_RX_4) 40(P7.3/CAN2_TX_4/LIN_TX_4/PWMETI_3) 41(P4.1/MISo_3/S1MISO_3/S2MISO_3/CMPO_2/PWMETI_2) 42(P4.2/WR/CAN_RX_3) 43(P4.3/RxD_4/SCLK_3/S1SCLK_3/S2SCLK_3) 44(P4.4/RD/TxD_4) 45(P2.0/A8/PWM1P_2/PWM5) 46(P2.1/A9/PWM1N_2/PWM6) 47(P2.2/A10/PWM2P_2/PWM7/SS_2/S1sS_2/S2SS_2) 48(P2.3/A11/PWM2N_2/PWM8/MOSI_2/S1MOSI_2/S2MOSl_2) 49(S2MISO_2/S1MISO_2/MISO_2/SDA_2/PWM3P_2/A12/P2.4) 50(S2SCLK_2/S1SCLK_2/SCLK_2/SCL_2/PWM3N_2/A13/P2.5) 51(PWM4P_2/A14/P2.6) 52(PWM4N_2/A15/P2.7) 53(S2SS_4/PWM5_4/P7.4) 54(S2MOSl_4/PWM6_4/P7.5) 55(S2MISO_4/PWM7_4/P7.6) 56(S2SCLK_4/PWM8_4/P7.7) 57(CAN_TX_3/ALE/P4.5) 58(LIN_RX_3/CAN2_RX_3/RxD2_2/P4.6) 59(CAN_RX/T3_2/PWM5_3/RxD3/ADC8/ADO/P0.0) 60(CAN_TX/T3CLKo_2/PWM6_3/TxD3/ADC9/AD1/P0.1) 61(LIN_RX/CAN2_RX/T4_2/PWM7_3/RxD4/ADC10/AD2/P0.2) 62(LIN_TX/CAN2_TX/T4CLKO_2/PWM8_3/TxD4/ADC11/AD3/P0.3) 63(T3/ADC12/AD4/P0.4) 64(LIlN_RX_2/CAN2_RX_2/RxD4_2/P5.2); USB2 0* A8(SBU1)* B8(SBU2)*

### Layout directives
differential pair; differential pair class Mini-DSO_USB: P30_Mini-DSO_N, P30_Mini-DSO_P

### Notes on the sheet
- Mini-DSO
- TFT LCD模组左边两个螺丝定位孔
- 仿自 STC官方开源STC32示波器
  https://www.stcai.com/newsinfo/4315738.html
  https://www.stcai.com/newsinfo/4315765.html
- (near BNC1) 示波器探头接口
- (near R9) 1KHz 参考方波输出
- (near C15) 差分等长走线
- (near R11) 给AD做基准
- 给W25QXX供电
- 靠近MCU的Vref引脚
- Title
- Start date:
- Revision:
- Sheet
- Last date:
- of
- Organization:
- Drawn by:
- Checked by:
- Size:
- A4
- (in symbol LM358, part A) A
- (in symbol LM358, part B) B

### Library data of the parts
1 = 5Key: 五向按键; BOM名称: 五向按键
BNC1 = BNC插座: 示波器探头插座，DOSIN-801-0083; BOM名称: 示波器探头插座，DOSIN-801-0083
C2 C4-C7 C9 C18 C21 C23 = C X5R: 无极性贴片电容 X5R
C3 C8 C10-C12 C15-C17 C19 C20 C22 C24 = C X7R: 无极性贴片电容 X7R
  C16: BOM名称: X7R
C13 C14 = C NP0: 无极性贴片电容 NP0
D1 = 1N4148: 高速开关二极管; 版权归属: 源创客; BOM名称: 高速开关二极管; 学习资源: www.ooocke.com
D2-D4 = 1N5819: 肖特基二极管; 版权归属: 源创客; 属性: 40V/2A; BOM名称: 肖特基二极管; 学习资源: www.ooocke.com
DR2 = DR: 瞬态电压抑制二极管; 版权归属: 源创客; BOM名称: 瞬态电压抑制二极管; 学习资源: www.ooocke.com
IC1 = LM358: 双路运放; 版权归属: 源创客; BOM名称: 双路运放; 学习资源: www.ooocke.com
IC2 = CD4051: 八选一; BOM名称: 八选一
IC3 = XC6206P332MR: 低压差线性稳压芯片; 版权归属: 源创客; BOM名称: 低压差线性稳压芯片; 学习资源: www.ooocke.com
IC4 = W25Qxx: 外置Flash; 版权归属: 源创客; BOM名称: 外置Flash; 学习资源: www.ooocke.com
IC5 = TL431_SMD: 可调基准稳压芯片; 版权归属: 源创客; BOM名称: 可调基准稳压芯片; 学习资源: www.ooocke.com
JP1 JP3 = Header 2: 2P接插件; 版权归属: 源创客; BOM名称: 2P接插件; 学习资源: www.ooocke.com
JP2 = Header 18X2: 18*2P接插件; 版权归属: 源创客; BOM名称: 18*2P接插件; 学习资源: www.ooocke.com
LB1 LB2 = LB: 磁珠 600R@100MHz; 版权归属: 源创客; BOM名称: 磁珠 600R@100MHz; 学习资源: www.ooocke.com
Q1 = 8550-SMD: 高频放大-PNP型; 版权归属: 源创客; 属性: 40V 1.5A 1W 100MHZ; BOM名称: 高频放大-PNP型; 学习资源: www.ooocke.com
Q2 = 8050-SMD: as Q3 on sheet 锂电池电量显示; BOM名称: 高频放大-NPN型; 学习资源: www.ooocke.com
R5-R11 = R: 贴片电阻 E-96 1%; BOM名称: E-96 1%
SP1 SP2 = 铜柱小焊盘: 铜柱; 版权归属: 源创客; BOM名称: 铜柱; 学习资源: www.ooocke.com
SW1 = TSW 3x6: 3x6轻触开关; 版权归属: 源创客; BOM名称: 3x6轻触开关; 学习资源: www.ooocke.com
TP3 = TEST: 测试点; 版权归属: 源创客; BOM名称: 测试点; 学习资源: www.ooocke.com
U1 = STC32G12K128-Beta-LQFP64: Manufacturer: STC(宏晶); Add into BOM: yes; Name: STC32G12K128-Beta-LQFP64; Symbol: STC32G12K128-BETA-LQFP64; Device: STC32G12K128-Beta-LQFP64; LCSC Part Name: STC32G12K128-Beta-LQFP64; Supplier Part: C3020367; Manufacturer Part: STC32G12K128-Beta-LQFP64; Supplier Footprint: LQFP-64; JLCPCB Part Class: Extended Part; Datasheet: https://atta.szlcsc.com/upload/public/pdf/source/20220519/F36B7AE14E7682CFD7D7CC400D8CC62F.pdf; Supplier: LCSC; Convert to PCB: yes
X1 = XTAL-4P: 4脚无源晶振; 版权归属: 源创客; BOM名称: 4脚无源晶振; 学习资源: www.ooocke.com

## Nets that join several sheets
G_BAT_out: Mini-DSO-WaveGen-in-one (9 pins), 1S锂电池保护 (5 pins), 锂电池电量显示 (LED3.2 LED4.2 R23.2), 1S锂电池充电_tp4054 (5 pins), 路径自动切换电路-第二类-小功率 (R27.1), Mini-WaveGen (C25.1 LB4.1), Mini-DSO (C4.1 LB2.1)
V_BAT_C: 1S锂电池保护 (R14.2 R15.2 R16.2), 锂电池电量显示 (Q3.3 Q4.3 SW3.2), 1S锂电池充电_tp4054 (C39.2 IC7.3), 路径自动切换电路-第二类-小功率 (Q5.3)
V_Sys: Mini-DSO-WaveGen-in-one (S1.2 S2.2), 路径自动切换电路-第二类-小功率 (F1.1)
VCC_5V: Mini-DSO-WaveGen-in-one (5 pins), 1S锂电池充电_tp4054 (C40.1 C41.2 IC7.4 R24.2), 路径自动切换电路-第二类-小功率 (D8.1 R26.2)
VCC_Mini-DSO: Mini-DSO-WaveGen-in-one (R3.1 S1.1), Mini-DSO (C4.2 LB1.1)
VCC_Mini-WG: Mini-DSO-WaveGen-in-one (R4.1 S2.1), Mini-WaveGen (C25.2 LB3.1)

## Assembly variants
Variant of Mini-DSO-WaveGen-in-one: all parts fitted